# Altium schematic sheet RIGHT_CCM.SchDoc: =project_title
size Tabloid; PageSetup: Record=PageOptions|CenterHorizontal=True|CenterVertical=True|PrintScale=0.71|XCorrection=1.00|YCorrection=1.00|PrintKind=0|BorderSize=5000000|LeftOffset=0|BottomOffset=0|Orientation=2|PaperLength=1000|PaperWidth=1000|Scale=100|PaperSource=7|PrintQuality=-4|MediaType=1|DitherType=10|PrintScaleMode=1|PaperKind=A4; CompanyName: Luxonis Holding; Organization: Luxonis Holding; Address1: 1925 Harmony Park Drive; Address2: Westminster, CO; Address3: 80234; Address4: United States; SheetNumber: 11; SheetTotal: 14
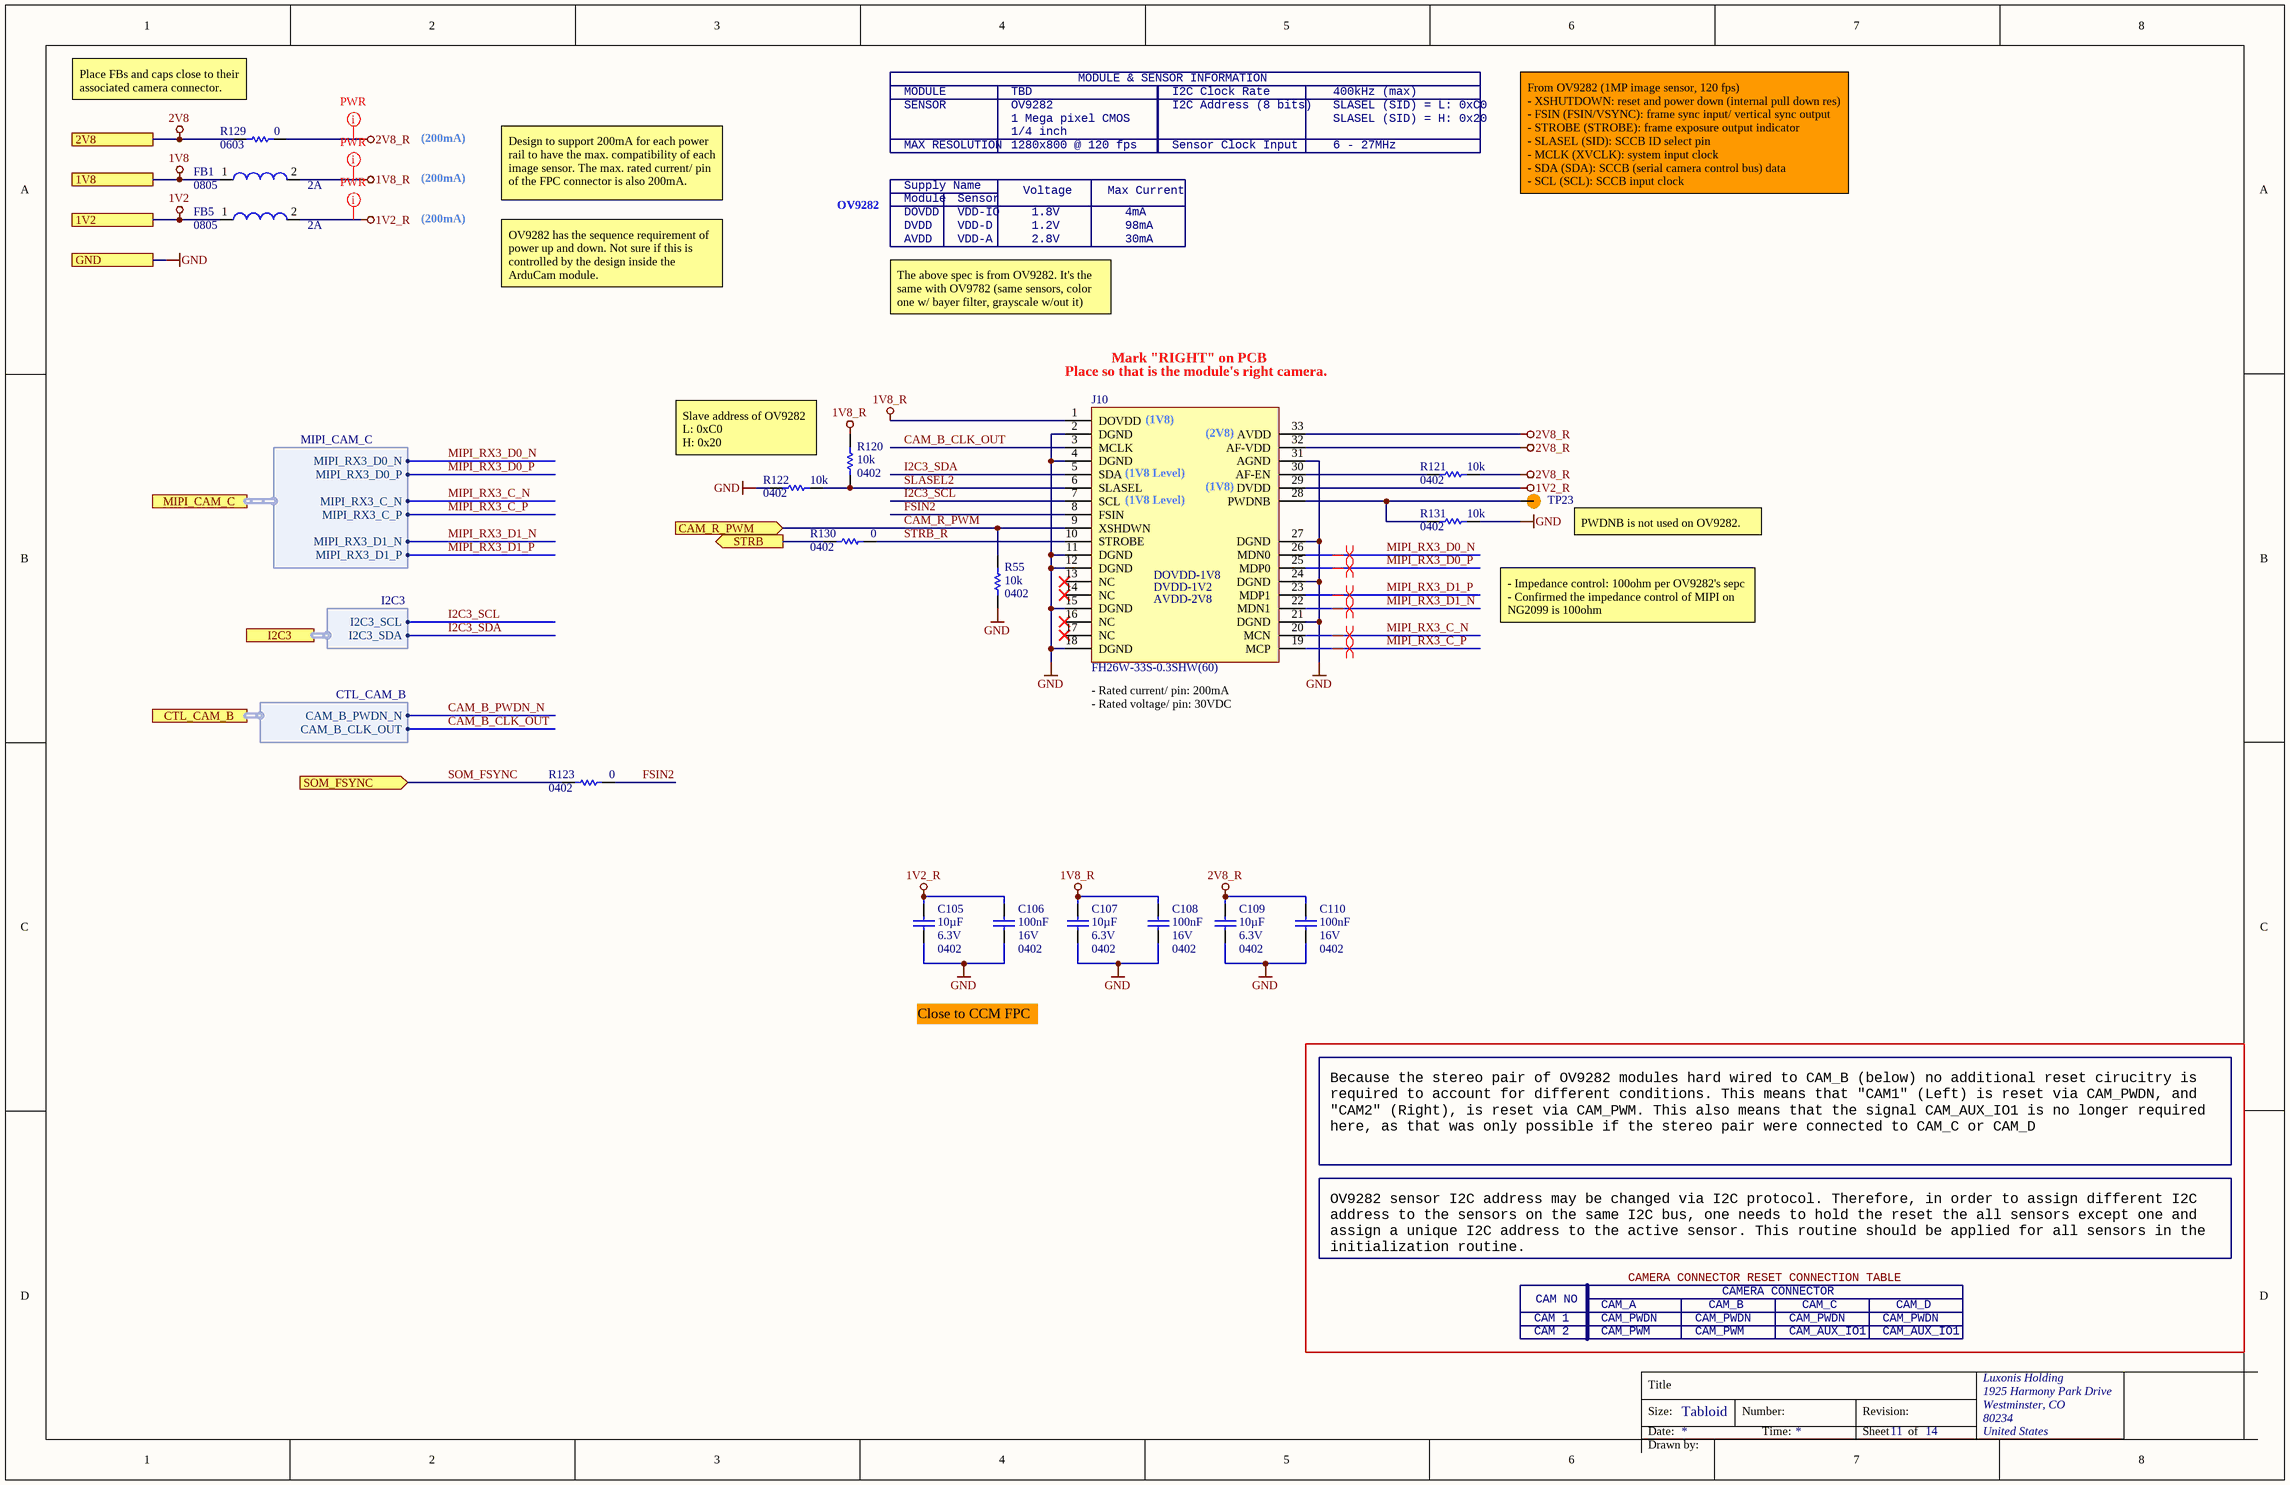
[diagram p0: RIGHT_CCM.SchDoc]

## Parts
C105  value 10µF  Voltage Rating: 6.3V  Case/Package: 0402  [CAPC0402(1005)70_N]  (hidden comment: GRM155R60J106ME15D)
C106  value 100nF  Voltage Rating: 16V  Case/Package: 0402  [CAPC0402(1005)60_N]  (hidden comment: CL05B104KO5NFNC)
C107  value 10µF  Voltage Rating: 6.3V  Case/Package: 0402  [CAPC0402(1005)70_N]  (hidden comment: GRM155R60J106ME15D)
C108  value 100nF  Voltage Rating: 16V  Case/Package: 0402  [CAPC0402(1005)60_N]  (hidden comment: CL05B104KO5NFNC)
C109  value 10µF  Voltage Rating: 6.3V  Case/Package: 0402  [CAPC0402(1005)70_N]  (hidden comment: GRM155R60J106ME15D)
C110  value 100nF  Voltage Rating: 16V  Case/Package: 0402  [CAPC0402(1005)60_N]  (hidden comment: CL05B104KO5NFNC)
FB1  Current Rating: 2A  Case/Package: 0805  [2508056017Y2]  (hidden comment: 2508056017Y2)
FB5  Current Rating: 2A  Case/Package: 0805  [2508056017Y2]  (hidden comment: 2508056017Y2)
J10  FH26W-33S-0.3SHW(60)  [AC-PY003-OV9282]
R55  value 10k  Case/Package: 0402  [RESC0402(1005)_N]  (hidden comment: RC0402FR-1310KL)
R120  value 10k  Case/Package: 0402  [RESC0402(1005)_N]  (hidden comment: RC0402FR-1310KL)
R121  value 10k  Case/Package: 0402  [RESC0402(1005)_N]  (hidden comment: RC0402FR-1310KL)
R122  value 10k  Case/Package: 0402  [RESC0402(1005)_N]  (hidden comment: RC0402FR-1310KL)
R123  value 0  Case/Package: 0402  [RESC0402(1005)_L]  (hidden comment: CRCW04020000Z0ED)
R129  value 0  Case/Package: 0603  [RESC0603(1608)_N]  (hidden comment: CRCW06030000Z0EA)
R130  value 0  Case/Package: 0402  [RESC0402(1005)_L]  (hidden comment: CRCW04020000Z0ED)
R131  value 10k  Case/Package: 0402  [RESC0402(1005)_N]  (hidden comment: RC0402FR-1310KL)
TP23  TP075_150_NS  [TP075_150_NS]  (value not drawn)  (no BOM)

## Ports
1V2, 1V8, 2V8, CAM_R_PWM (in), CTL_CAM_B (harness CTL_CAM_B), GND, I2C3 (harness I2C3), MIPI_CAM_C (harness MIPI_CAM_C), SOM_FSYNC (in), STRB (out)

## Harnesses
MIPI_CAM_C: MIPI_RX3_D1_P, MIPI_RX3_D1_N, MIPI_RX3_D0_N, MIPI_RX3_D0_P, MIPI_RX3_C_N, MIPI_RX3_C_P
I2C3: I2C3_SDA, I2C3_SCL
CTL_CAM_B: CAM_B_PWDN_N, CAM_B_CLK_OUT

## Nets
1V2: FB5.1 ; port 1V2
1V2_R: C105.2 C106.2 FB5.2 J10.29(DVDD)
1V8: FB1.1 ; port 1V8
1V8_R: C107.2 C108.2 FB1.2 J10.1(DOVDD) R120.2
2V8: R129.1 ; port 2V8
2V8_R: C109.2 C110.2 J10.32(AF-VDD) J10.33(AVDD) R121.2 R129.2
GND: C105.1 C106.1 C107.1 C108.1 C109.1 C110.1 J10.2(DGND) J10.4(DGND) J10.11(DGND) J10.12(DGND) J10.15(DGND) J10.18(DGND) J10.21(DGND) J10.24(DGND) J10.27(DGND) J10.31(AGND) R55.1 R122.1 R131.2 ; port GND
CAM_B_CLK_OUT: J10.3(MCLK) ; port CTL_CAM_B.CAM_B_CLK_OUT
CAM_B_PWDN_N: port CTL_CAM_B.CAM_B_PWDN_N
CAM_R_PWM: J10.9(XSHDWN) R55.2 ; port CAM_R_PWM
FSIN2: J10.8(FSIN) R123.1
I2C3_SCL: J10.7(SCL) ; port I2C3.I2C3_SCL
I2C3_SDA: J10.5(SDA) ; port I2C3.I2C3_SDA
MIPI_RX3_C_N: J10.20(MCN) ; port MIPI_CAM_C.MIPI_RX3_C_N
MIPI_RX3_C_P: J10.19(MCP) ; port MIPI_CAM_C.MIPI_RX3_C_P
MIPI_RX3_D0_N: J10.26(MDN0) ; port MIPI_CAM_C.MIPI_RX3_D0_N
MIPI_RX3_D0_P: J10.25(MDP0) ; port MIPI_CAM_C.MIPI_RX3_D0_P
MIPI_RX3_D1_N: J10.22(MDN1) ; port MIPI_CAM_C.MIPI_RX3_D1_N
MIPI_RX3_D1_P: J10.23(MDP1) ; port MIPI_CAM_C.MIPI_RX3_D1_P
SLASEL2: J10.6(SLASEL) R120.1 R122.2
SOM_FSYNC: R123.2 ; port SOM_FSYNC
STRB: R130.2 ; port STRB
STRB_R: J10.10(STROBE) R130.1
NetJ10_28: J10.28(PWDNB) R131.1 TP23.1
NetJ10_30: J10.30(AF-EN) R121.1

Not connected (* = marked no-connect by the designer): J10 13(NC)* 14(NC)* 16(NC)* 17(NC)*

## Layout directives
differential pair; net class MIPI; differential pair class 100ohm: MIPI_RX3_C_N, MIPI_RX3_C_P, MIPI_RX3_D0_N, MIPI_RX3_D0_P, MIPI_RX3_D1_N, MIPI_RX3_D1_P
net class PWR; Current Rating: 200mA: 1V2_R, 1V8_R, 2V8_R

## Notes on the sheet
- (near R129) Place FBs and caps close to their associated camera connector.
- MODULE
- TBD
- MODULE & SENSOR INFORMATION
- I2C Clock Rate
- 400kHz (max)
- (200mA)
- SENSOR
- MAX RESOLUTION
- 1 Mega pixel CMOS
- 1280x800 @ 120 fps
- OV9282
- 1/4 inch
- I2C Address (8 bits)
- Sensor Clock Input
- SLASEL (SID) = L: 0xC0
- SLASEL (SID) = H: 0x20
- 6 - 27MHz
- Design to support 200mA for each power rail to have the max. compatibility of each image sensor. The max. rated current/ pin of the FPC connector is also 200mA.
- DOVDD
- DVDD
- Supply Name
- Module
- VDD-IO
- VDD-D
- Sensor
- Voltage
- 1.8V
- 1.2V
- Max Current
- 4mA
- 98mA
- From OV9282 (1MP image sensor, 120 fps)
  - XSHUTDOWN: reset and power down (internal pull down res)
  - FSIN (FSIN/VSYNC): frame sync input/ vertical sync output
  - STROBE (STROBE): frame exposure output indicator
  - SLASEL (SID): SCCB ID select pin
  - MCLK (XVCLK): system input clock
  - SDA (SDA): SCCB (serial camera control bus) data
  - SCL (SCL): SCCB input clock
- OV9282 has the sequence requirement of power up and down. Not sure if this is controlled by the design inside the ArduCam module.
- AVDD
- VDD-A
- 2.8V
- 30mA
- The above spec is from OV9282. It's the same with OV9782 (same sensors, color one w/ bayer filter, grayscale w/out it)
- Mark "RIGHT" on PCB
- (near J10) Place so that is the module's right camera.
- (near J10) (1V8)
- (near J10) (2V8)
- Slave address of OV9282
  L: 0xC0
  H: 0x20
- (near J10) (1V8 Level)
- (near TP23) PWDNB is not used on OV9282.
- - Impedance control: 100ohm per OV9282's sepc
  - Confirmed the impedance control of MIPI on NG2099 is 100ohm
- (near J10) - Rated current/ pin: 200mA
  - Rated voltage/ pin: 30VDC
- Close to CCM FPC
- Because the stereo pair of OV9282 modules hard wired to CAM_B (below) no additional reset cirucitry is required to account for different conditions. This means that "CAM1" (Left) is reset via CAM_PWDN, and "CAM2" (Right), is reset via CAM_PWM. This also means that the signal CAM_AUX_IO1 is no longer required here, as that was only possible if the stereo pair were connected to CAM_C or CAM_D
- OV9282 sensor I2C address may be changed via I2C protocol. Therefore, in order to assign different I2C address to the sensors on the same I2C bus, one needs to hold the reset the all sensors except one and assign a unique I2C address to the active sensor. This routine should be applied for all sensors in the initialization routine.
- CAM NO
- CAMERA CONNECTOR RESET CONNECTION TABLE
- CAMERA CONNECTOR
- CAM 1
- CAM 2
- CAM_A
- CAM_PWDN
- CAM_PWM
- CAM_B
- CAM_AUX_IO1
- CAM_C
- CAM_D
- Title
- Size:
- Date:
- Tabloid
- Number:
- Time:
- Revision:
- Sheet
- of
- Drawn by:
- (in symbol AC_PY003-OV9282_CON) DOVDD-1V8; DVDD-1V2; AVDD-2V8

## Library data of the parts
C105 C107 C109 = CMP-004-000009-5: CAP CER 10UF 6.3V X5R 0402 20%; Manufacturer 1: Murata; Dielectric: X5R; Manufacturer Part Number 1: GRM155R60J106ME15D; ComponentLink1URL: https://www.murata.com/~/media/webrenewal/support/library/catalog/products/capacitor/mlcc/c02e.ashx?la=en-us&src-supplier=Digi-Key; Design Item ID: GRM155R60J106ME15D; Tolerance: 20%; Width: 0.02inch; Length: 0.039inch; Mounting Technology: SMT; Min Operating Temperature: -55°C; Max Operating Temperature: 85°C; ComponentLink1Description: https://www.murata.com/~/media/webrenewal/support/library/catalog/products/capacitor/mlcc/c02e.ashx?la=en-us&src-supplier=Digi-Key
C106 C108 C110 = CMP-108-000002-6: CAP CER 0.1UF 16V X7R 0402 10%; Manufacturer 1: Samsung; ComponentLink1URL: https://datasheet.ciiva.com/25767/cl05b104ko5nfnc-25767124.pdf?src-supplier=Digi-Key; Length: 1mm; Design Item ID: CL05B104KO5NFNC; Tolerance: 10%; Min Operating Temperature: -55°C; Width: 0.02inch; Dielectric: X7R; ComponentLink1Description: https://datasheet.ciiva.com/25767/cl05b104ko5nfnc-25767124.pdf?src-supplier=Digi-Key; Height: 0.5mm; Depth: 0.5mm; Manufacturer Part Number 1: CL05B104KO5NFNC; Max Operating Temperature: 125°C; Mounting Technology: SMT
FB1 FB5 = CMP-082-000000-2: FERRITE BEAD, 0.1OHM, 2A, 0805, 600R/100MHz; Manufacturer 1: Fair-Rite; Tolerance: 25%; Manufacturer Part Number 1: 2508056017Y2
J10 = AC_PY003-OV9282_CON: FFC/FPC Connector, 33 Contact(s), 1 Row(s), Female, Right Angle, Surface Mount Terminal; Manufacturer 1: Hirose; Supplier 1: Digi-Key; Manufacturer Part Number 1: FH26W-33S-0.3SHW(60); RoHS: Yes; Category: FFC / FPC; Stock 1: 627; Pricing 1: 1=1,78000, 10=1,61700, 25=1,51800, 50=1,45200, 100=1,38600, 250=1,25400, 500=1,15500, 1000=0,99000, 2500=0,92400 (USD); ComponentLink1URL: https://datasheet.ciiva.com:443/pdfs/VipMasterIC/IC/HIRO/HIRO-S-A0007913874/HIRO-S-A0008593114-1.pdf?src-supplier=IHS+Markit; ComponentLink1Description: https://datasheet.ciiva.com:443/pdfs/VipMasterIC/IC/HIRO/HIRO-S-A0007913874/HIRO-S-A0008593114-1.pdf?src-supplier=IHS+Markit; ComponentLink2URL: https://www.hirose.com/product/en/download_file/key_name/FH26/category/Catalog/doc_file_id/49355/?file_category_id=4&item_id=298&is_series=1&src-supplier=Digi-Key; ComponentLink2Description: https://www.hirose.com/product/en/download_file/key_name/FH26/category/Catalog/doc_file_id/49355/?file_category_id=4&item_id=298&is_series=1&src-supplier=Digi-Key; ComponentLink3URL: https://www.hirose.com/product/download/?distributor=digikey&amp;type=2d&amp;lang=en&amp;num=FH26W-13S-0.3SHW(60)&src-supplier=Digi-Key; ComponentLink3Description: https://www.hirose.com/product/download/?distributor=digikey&amp;type=2d&amp;lang=en&amp;num=FH26W-13S-0.3SHW(60)&src-supplier=Digi-Key; Supplier Part Number 1: H125800CT-ND
R55 R120-R122 R131 = CMP-115-000004-8: RES SMD 10K OHM 1% 1/16W 0402; Manufacturer 1: Yageo; Power Rating: 62.5mW; Temperature Coefficient: 100ppm/°C; Voltage Rating: 50V; Min Operating Temperature: -55°C; Max Operating Temperature: 155°C; Design Item ID: RC0402FR-1310KL; Tolerance: 1%; Manufacturer Part Number 1: RC0402FR-1310KL
R123 R130 = CMP-013-000022-11: RES SMD 0 OHM 5% 1/16W 0402; Manufacturer 1: Vishay; Voltage Rating: 50V; Power Rating: 63mW; Max Operating Temperature: 155°C; Manufacturer Part Number 1: CRCW04020000Z0ED; Tolerance: 5%; Min Operating Temperature: -55°C; Design Item ID: CRCW04020000Z0ED
R129 = CMP-115-000011-7: RES SMD 0 OHM 5% 1/10W 0603; Manufacturer 1: Vishay; Manufacturer Part Number 1: CRCW0603-0000Z0EA; Temperature Coefficient: 100ppm/°C; Power Rating: 100mW; Voltage Rating: 75V; Tolerance: 5%; Design Item ID: CRCW06030000Z0EA; Max Operating Temperature: 155°C; Min Operating Temperature: -55°C
TP23 = TEST_POINT